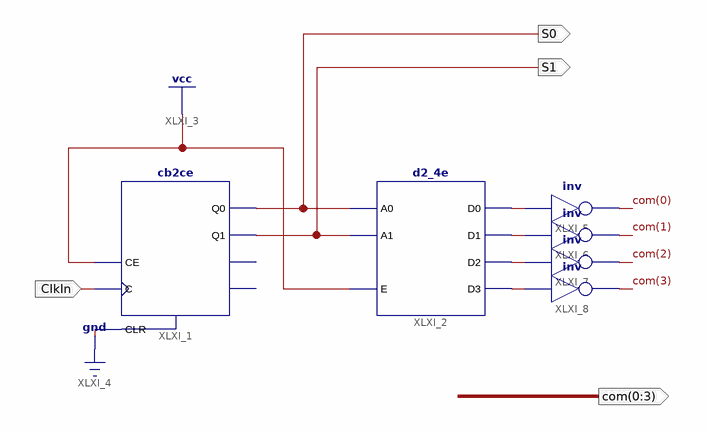
[diagram p0: schematic sheet 1]
// Xilinx ISE schematic blockForCommon.sch (spartan6) as structural Verilog: 6 symbols, 4 ports
module blockForCommon (
  input  ClkIn,
  output [0:3] com,
  output S0,
  output S1
);

  wire XLXN_6, XLXN_7, XLXN_8, XLXN_9;

  cb2ce XLXI_1 (.C(ClkIn), .CE(1'b1), .CLR(1'b0), .Q0(S0), .Q1(S1));  // open: CEO, TC
  d2_4e XLXI_2 (.A0(S0), .A1(S1), .E(1'b1), .D0(XLXN_6), .D1(XLXN_7), .D2(XLXN_8), .D3(XLXN_9));
  not XLXI_5 (com[0], XLXN_6);
  not XLXI_6 (com[1], XLXN_7);
  not XLXI_7 (com[2], XLXN_8);
  not XLXI_8 (com[3], XLXN_9);
endmodule
